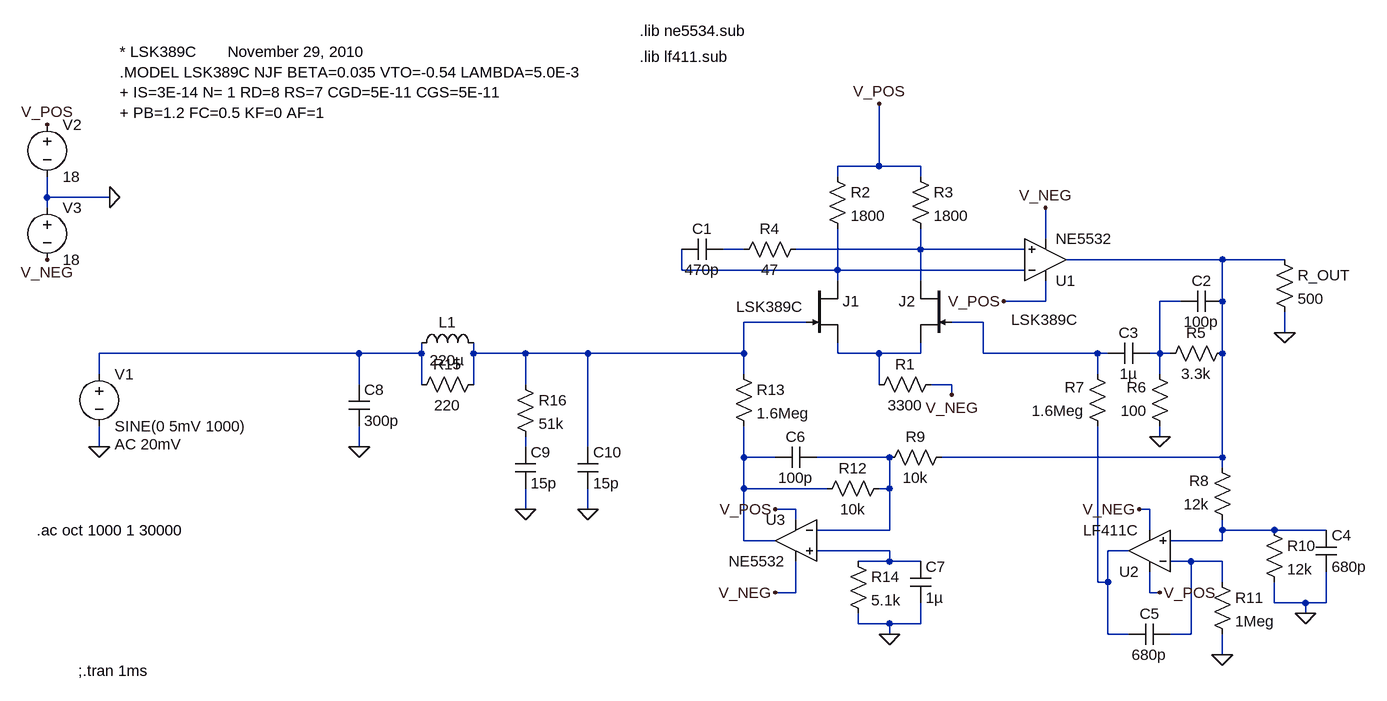
[diagram p0: schematic input_stage_actidamp.asc]
input_stage_actidamp.asc, the LTspice schematic file:
Version 4
SHEET 1 936 680
WIRE 176 -112 176 -208
WIRE 176 -112 112 -112
WIRE 240 -112 176 -112
WIRE 112 -96 112 -112
WIRE 240 -96 240 -112
WIRE -1104 -64 -1104 -96
WIRE -1008 -64 -1104 -64
WIRE -1104 -48 -1104 -64
WIRE 432 0 432 -48
WIRE -32 16 -64 16
WIRE 240 16 240 -16
WIRE 240 16 48 16
WIRE 400 16 240 16
WIRE 704 32 464 32
WIRE 800 32 704 32
WIRE -128 48 -128 16
WIRE 112 48 112 -16
WIRE 112 48 -128 48
WIRE 400 48 112 48
WIRE 112 64 112 48
WIRE 240 64 240 16
WIRE 432 96 432 64
WIRE 432 96 368 96
WIRE 640 96 608 96
WIRE 704 96 704 32
WIRE 64 128 -32 128
WIRE 336 128 288 128
WIRE 800 144 800 112
WIRE -624 176 -1024 176
WIRE -528 176 -528 160
WIRE -528 176 -624 176
WIRE -448 176 -448 160
WIRE -368 176 -448 176
WIRE -272 176 -368 176
WIRE -32 176 -32 128
WIRE -32 176 -272 176
WIRE 112 176 112 160
WIRE 176 176 112 176
WIRE 240 176 240 160
WIRE 240 176 176 176
WIRE 336 176 336 128
WIRE 512 176 336 176
WIRE 528 176 512 176
WIRE 608 176 608 96
WIRE 608 176 592 176
WIRE 624 176 608 176
WIRE 704 176 704 96
WIRE -1024 208 -1024 176
WIRE -32 208 -32 176
WIRE 512 208 512 176
WIRE 608 208 608 176
WIRE -624 224 -624 176
WIRE -528 224 -528 176
WIRE -448 224 -448 176
WIRE -368 224 -368 176
WIRE 176 224 176 176
WIRE 288 224 256 224
WIRE 288 240 288 224
WIRE 608 304 608 288
WIRE -1024 320 -1024 288
WIRE -624 320 -624 288
WIRE -368 320 -368 304
WIRE -272 320 -272 176
WIRE -32 336 -32 288
WIRE 16 336 -32 336
WIRE 192 336 80 336
WIRE 704 336 704 176
WIRE 704 336 272 336
WIRE 704 352 704 336
WIRE -32 384 -32 336
WIRE 96 384 -32 384
WIRE 192 384 192 336
WIRE 192 384 176 384
WIRE -368 416 -368 384
WIRE -272 416 -272 384
WIRE 48 416 16 416
WIRE 592 416 576 416
WIRE 48 432 48 416
WIRE 192 448 192 384
WIRE 192 448 80 448
WIRE 592 448 592 416
WIRE 704 448 704 432
WIRE 784 448 704 448
WIRE 864 448 784 448
WIRE -32 464 -32 384
WIRE 16 464 -32 464
WIRE 704 464 704 448
WIRE 704 464 624 464
WIRE 192 480 80 480
WIRE 560 480 528 480
WIRE 192 496 192 480
WIRE 192 496 144 496
WIRE 240 496 192 496
WIRE 656 496 624 496
WIRE 704 496 656 496
WIRE 512 528 512 288
WIRE 528 528 528 480
WIRE 528 528 512 528
WIRE 704 528 704 496
WIRE 48 544 48 496
WIRE 48 544 16 544
WIRE 592 544 592 512
WIRE 608 544 592 544
WIRE 784 560 784 528
WIRE 832 560 784 560
WIRE 864 560 864 512
WIRE 864 560 832 560
WIRE 832 576 832 560
WIRE 144 592 144 576
WIRE 192 592 144 592
WIRE 240 592 240 560
WIRE 240 592 192 592
WIRE 192 608 192 592
WIRE 528 608 528 528
WIRE 560 608 528 608
WIRE 656 608 656 496
WIRE 656 608 624 608
WIRE 704 640 704 608
FLAG 368 96 V_POS
FLAG 432 -48 V_NEG
FLAG 288 240 V_NEG
FLAG 176 -208 V_POS
FLAG 800 144 0
FLAG 608 304 0
FLAG 832 576 0
FLAG 704 640 0
FLAG 192 608 0
FLAG 16 544 V_NEG
FLAG 16 416 V_POS
FLAG 576 416 V_NEG
FLAG 608 544 V_POS
FLAG -1024 320 0
FLAG -1008 -64 0
FLAG -1104 -176 V_POS
FLAG -1104 32 V_NEG
FLAG -624 320 0
FLAG -368 416 0
FLAG -272 416 0
SYMBOL njf 64 64 R0
WINDOW 3 -108 40 Left 2
SYMATTR Value LSK389C
SYMATTR InstName J1
SYMBOL njf 288 64 M0
WINDOW 3 -194 60 Left 2
SYMATTR Value LSK389C
SYMATTR InstName J2
SYMBOL res 272 208 R90
WINDOW 0 0 56 VBottom 2
WINDOW 3 32 56 VTop 2
SYMATTR InstName R1
SYMATTR Value 3300
SYMBOL res 96 -112 R0
SYMATTR InstName R2
SYMATTR Value 1800
SYMBOL res 224 -112 R0
SYMATTR InstName R3
SYMATTR Value 1800
SYMBOL res 64 0 R90
WINDOW 0 0 56 VBottom 2
WINDOW 3 32 56 VTop 2
SYMATTR InstName R4
SYMATTR Value 47
SYMBOL cap -64 0 R90
WINDOW 0 0 32 VBottom 2
WINDOW 3 32 32 VTop 2
SYMATTR InstName C1
SYMATTR Value 470p
SYMBOL Opamps\\opamp2 432 96 M180
SYMATTR InstName U1
SYMATTR Value NE5532
SYMBOL res 784 16 R0
SYMATTR InstName R_OUT
SYMATTR Value 500
SYMBOL Opamps\\opamp2 592 544 R180
SYMATTR InstName U2
SYMATTR Value LF411C
SYMBOL Opamps\\opamp2 48 400 M0
SYMATTR InstName U3
SYMATTR Value NE5532
SYMBOL cap 704 80 R90
WINDOW 0 0 32 VBottom 2
WINDOW 3 32 32 VTop 2
SYMATTR InstName C2
SYMATTR Value 100p
SYMBOL cap 592 160 R90
WINDOW 0 0 32 VBottom 2
WINDOW 3 32 32 VTop 2
SYMATTR InstName C3
SYMATTR Value 1µ
SYMBOL res 720 160 R90
WINDOW 0 0 56 VBottom 2
WINDOW 3 32 56 VTop 2
SYMATTR InstName R5
SYMATTR Value 3.3k
SYMBOL res 624 304 R180
WINDOW 0 36 76 Left 2
WINDOW 3 36 40 Left 2
SYMATTR InstName R6
SYMATTR Value 100
SYMBOL res 528 304 R180
WINDOW 0 36 76 Left 2
WINDOW 3 36 40 Left 2
SYMATTR InstName R7
SYMATTR Value 1.6Meg
SYMBOL res 720 448 R180
WINDOW 0 36 76 Left 2
WINDOW 3 36 40 Left 2
SYMATTR InstName R8
SYMATTR Value 12k
SYMBOL res 288 320 R90
WINDOW 0 0 56 VBottom 2
WINDOW 3 32 56 VTop 2
SYMATTR InstName R9
SYMATTR Value 10k
SYMBOL res 768 432 R0
SYMATTR InstName R10
SYMATTR Value 12k
SYMBOL cap 848 448 R0
SYMATTR InstName C4
SYMATTR Value 680p
SYMBOL cap 624 592 R90
WINDOW 0 0 32 VBottom 2
WINDOW 3 32 32 VTop 2
SYMATTR InstName C5
SYMATTR Value 680p
SYMBOL res 688 512 R0
SYMATTR InstName R11
SYMATTR Value 1Meg
SYMBOL res 192 368 R90
WINDOW 0 0 56 VBottom 2
WINDOW 3 32 56 VTop 2
SYMATTR InstName R12
SYMATTR Value 10k
SYMBOL cap 80 320 R90
WINDOW 0 0 32 VBottom 2
WINDOW 3 32 32 VTop 2
SYMATTR InstName C6
SYMATTR Value 100p
SYMBOL res -48 192 R0
SYMATTR InstName R13
SYMATTR Value 1.6Meg
SYMBOL res 128 480 R0
SYMATTR InstName R14
SYMATTR Value 5.1k
SYMBOL cap 224 496 R0
SYMATTR InstName C7
SYMATTR Value 1µ
SYMBOL voltage -1024 192 R0
WINDOW 123 24 124 Left 2
WINDOW 39 24 152 Left 2
SYMATTR Value2 AC 20mV
SYMATTR InstName V1
SYMATTR Value SINE(0 5mV 1000)
SYMBOL voltage -1104 -192 R0
WINDOW 123 0 0 Left 0
WINDOW 39 0 0 Left 0
SYMATTR InstName V2
SYMATTR Value 18
SYMBOL voltage -1104 -64 R0
WINDOW 123 0 0 Left 0
WINDOW 39 0 0 Left 0
SYMATTR InstName V3
SYMATTR Value 18
SYMBOL ind -544 176 R270
WINDOW 0 32 56 VTop 2
WINDOW 3 5 56 VBottom 2
SYMATTR InstName L1
SYMATTR Value 220µ
SYMBOL res -432 208 R90
WINDOW 0 0 56 VBottom 2
WINDOW 3 32 56 VTop 2
SYMATTR InstName R15
SYMATTR Value 220
SYMBOL cap -640 224 R0
SYMATTR InstName C8
SYMATTR Value 300p
SYMBOL res -384 208 R0
SYMATTR InstName R16
SYMATTR Value 51k
SYMBOL cap -384 320 R0
SYMATTR InstName C9
SYMATTR Value 15p
SYMBOL cap -288 320 R0
SYMATTR InstName C10
SYMATTR Value 15p
TEXT -192 -320 Left 2 !.lib ne5534.sub
TEXT -192 -280 Left 2 !.lib lf411.sub
TEXT -992 -288 Left 2 !* LSK389C       November 29, 2010\n.MODEL LSK389C NJF BETA=0.035 VTO=-0.54 LAMBDA=5.0E-3           \n+ IS=3E-14 N= 1 RD=8 RS=7 CGD=5E-11 CGS=5E-11           \n+ PB=1.2 FC=0.5 KF=0 AF=1
TEXT -1056 664 Left 2 !;.tran 1ms
TEXT -1120 448 Left 2 !.ac oct 1000 1 30000

The netlist it stands for:
* input_stage_actidamp.asc
J1 N004 N006 N009 LSK389C
J2 N002 N007 N009 LSK389C
R1 V_NEG N009 3300
R2 V_POS N004 1800
R3 V_POS N002 1800
R4 N002 N001 47
C1 N001 N004 470p
XU1 N002 N004 V_POS V_NEG N003 NE5532  ; pins In+ In- V+ V- OUT
R_OUT N003 0 500
XU2 N013 N016 V_POS V_NEG N015 LF411C  ; pins In+ In- V+ V- OUT
XU3 N014 N012 V_POS V_NEG N011 NE5532  ; pins In+ In- V+ V- OUT
C2 N003 N005 100p
C3 N005 N007 1µ
R5 N003 N005 3.3k
R6 0 N005 100
R7 N015 N007 1.6Meg
R8 N013 N003 12k
R9 N003 N012 10k
R10 N013 0 12k
C4 N013 0 680p
C5 N016 N015 680p
R11 N016 0 1Meg
R12 N012 N011 10k
C6 N012 N011 100p
R13 N006 N011 1.6Meg
R14 N014 0 5.1k
C7 N014 0 1µ
V1 N008 0 SINE(0 5mV 1000) AC 20mV
V2 V_POS 0 18
V3 0 V_NEG 18
L1 N008 N006 220µ
R15 N006 N008 220
C8 N008 0 300p
R16 N006 N010 51k
C9 N010 0 15p
C10 N006 0 15p
.model NJF NJF
.model PJF PJF
.lib standard.jft
.lib ne5534.sub
.lib lf411.sub
* LSK389C       November 29, 2010
.MODEL LSK389C NJF BETA=0.035 VTO=-0.54 LAMBDA=5.0E-3
+ IS=3E-14 N= 1 RD=8 RS=7 CGD=5E-11 CGS=5E-11
+ PB=1.2 FC=0.5 KF=0 AF=1
;.tran 1ms
.ac oct 1000 1 30000
.backanno
.end